# Altium project IMX219_Bridge.PrjPcb
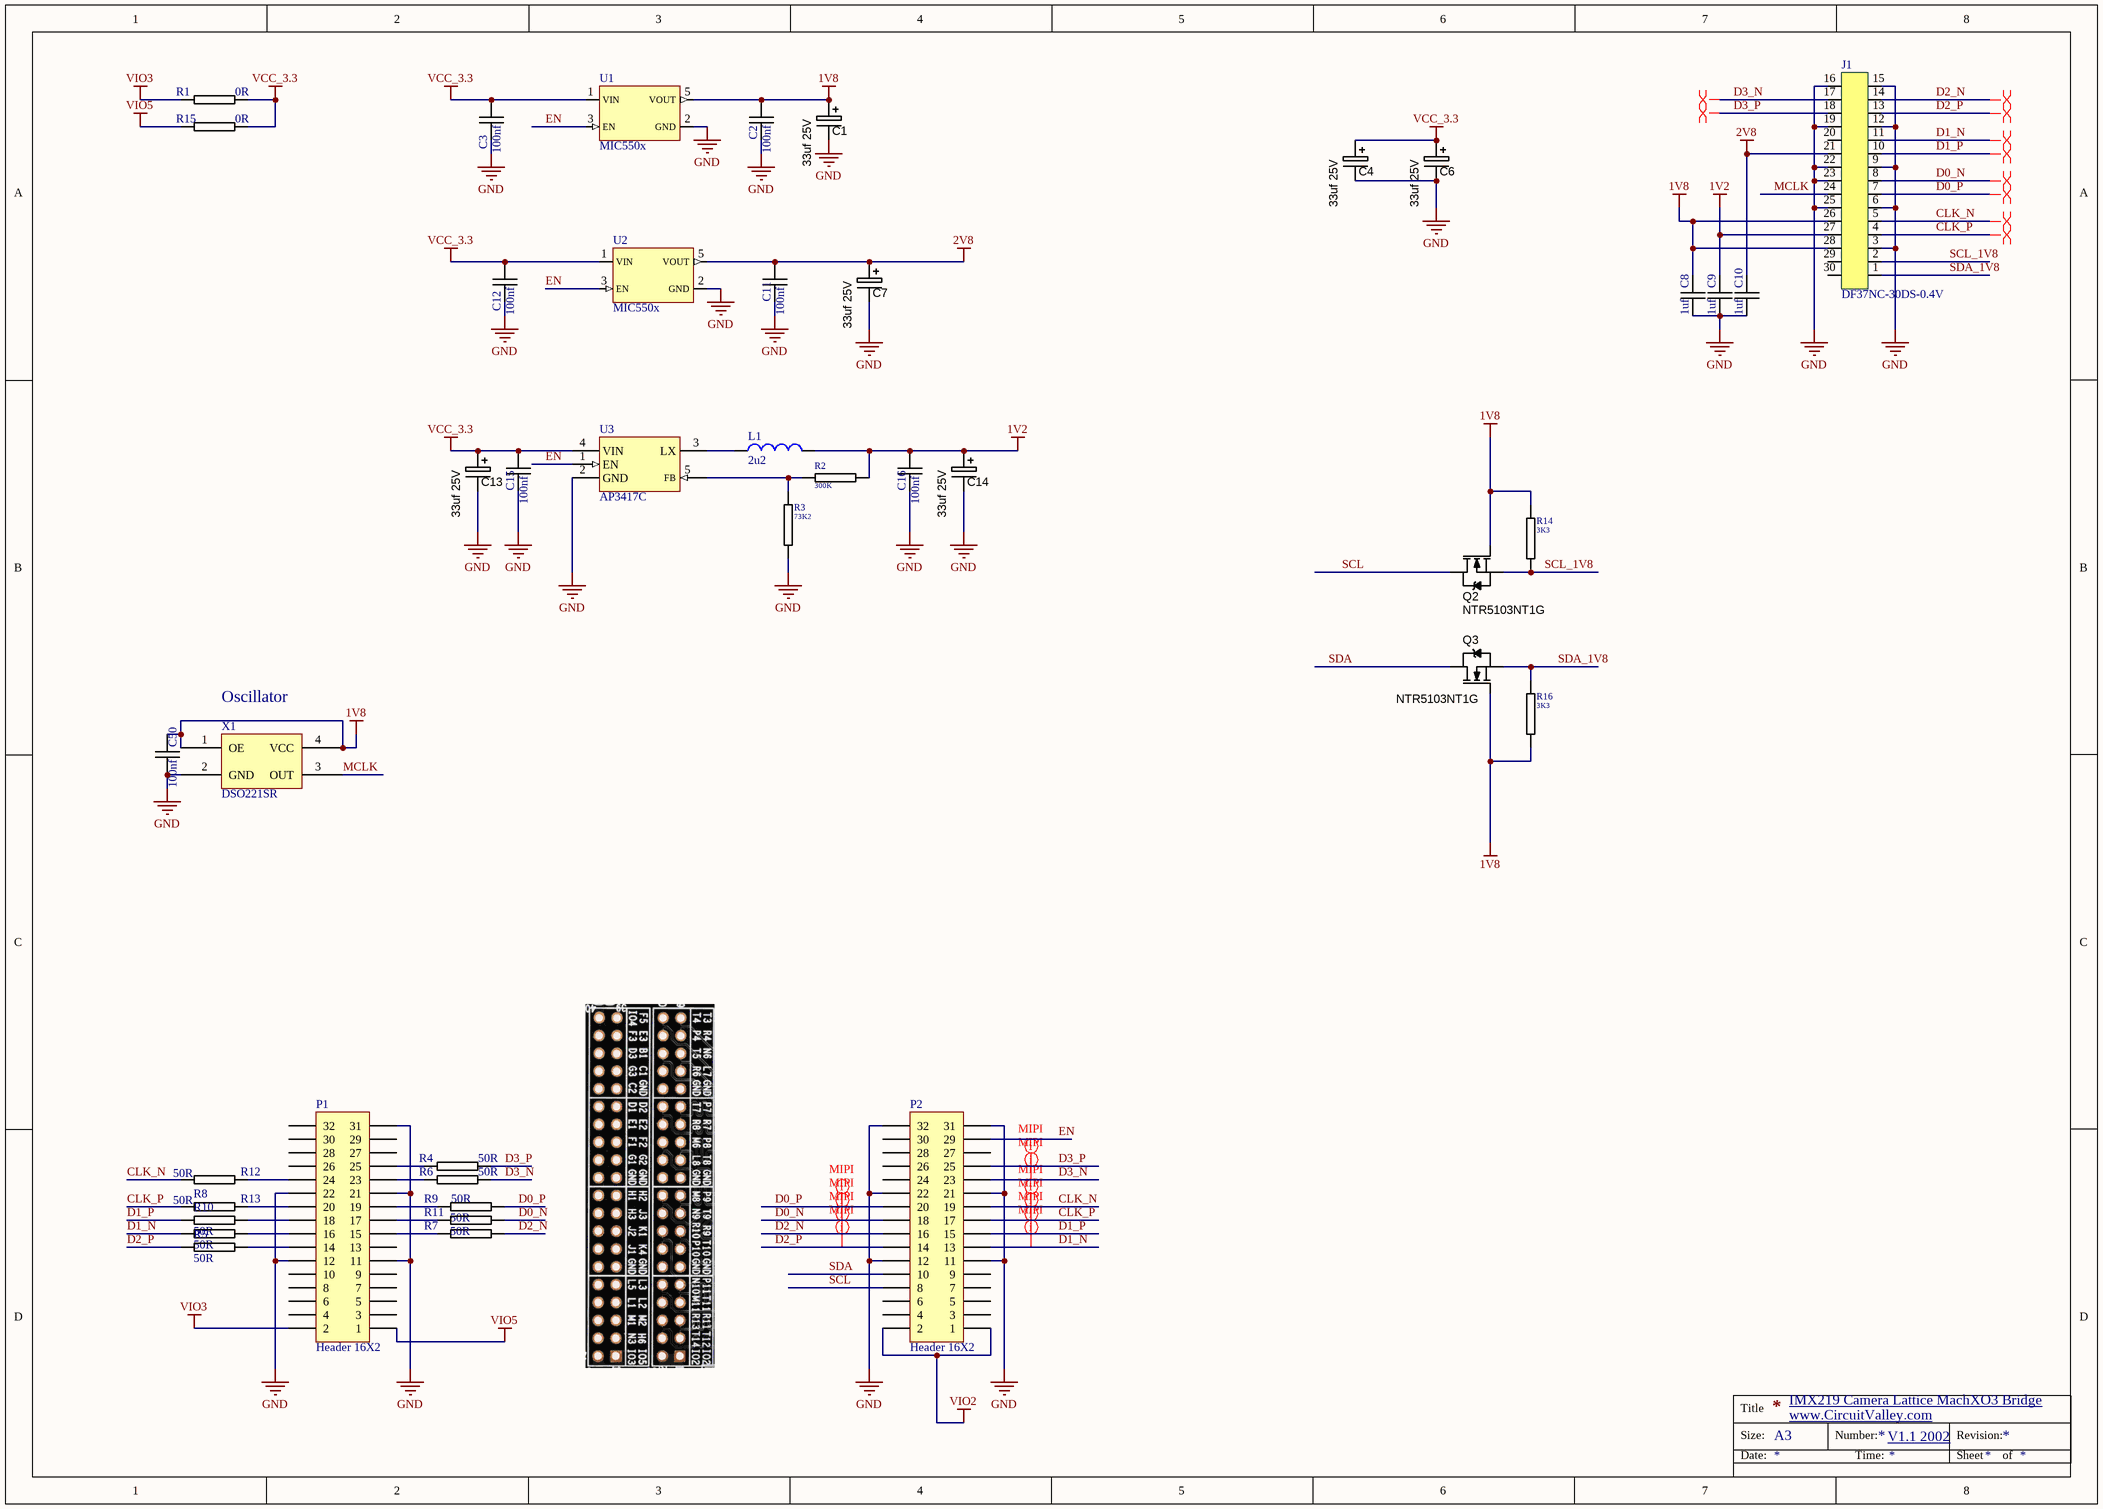
[diagram p0: IMX219_Bridge.SchDoc]
1 sheet, 42 parts. Net scope: global (net labels, ports and power ports of the same name join across sheets).
Board file: IMX219_Bridge.PcbDoc

## Sheet IMX219_Bridge.SchDoc
size A3

### Parts
C1  value 33uf 25V  [CAPMP7343X310N]  (hidden comment: 33uf 20V D)
C2  100nf  [0603C-GENERIC]
C3  100nf  [0603C-GENERIC]
C4  value 33uf 25V  [CAPMP7343X310N]  (hidden comment: 33uf 20V D)
C6  value 33uf 25V  [CAPMP7343X310N]  (hidden comment: 33uf 20V D)
C7  value 33uf 25V  [CAPMP7343X310N]  (hidden comment: 33uf 20V D)
C8  1uf  [0805C-TBD]
C9  1uf  [0805C-TBD]
C10  1uf  [0805C-TBD]
C11  100nf  [0603C-GENERIC]
C12  100nf  [0603C-GENERIC]
C13  value 33uf 25V  [CAPMP7343X310N]  (hidden comment: 33uf 20V D)
C14  value 33uf 25V  [CAPMP7343X310N]  (hidden comment: 33uf 20V D)
C15  100nf  [0603C-GENERIC]
C16  100nf  [0603C-GENERIC]
C50  100nf  [0603C-GENERIC]
J1  DF37NC-30DS-0.4V  [DF37NC-30DS-0.4V]
L1  2u2  [TAIYO_NRS4018T2R2MDGJ]
P1  Header 16X2  [HDR2X16]
P2  Header 16X2  [HDR2X16]
Q2  NTR5103NT1G  [SOT23-3]
Q3  NTR5103NT1G  [SOT23-3]
R1  0R  [0805R-0R1]
R2  300K  [0603R-10K]
R3  73K2  [0603R-10K]
R4  50R  [0805R-0R1]
R5  50R  [0805R-0R1]
R6  50R  [0805R-0R1]
R7  50R  [0805R-0R1]
R8  50R  [0805R-0R1]
R9  50R  [0805R-0R1]
R10  50R  [0805R-0R1]
R11  50R  [0805R-0R1]
R12  50R  [0805R-0R1]
R13  50R  [0805R-0R1]
R14  3K3  [0603R-10K]
R15  0R  [0805R-0R1]
R16  3K3  [0603R-10K]
U1  MIC550x  [SOT23-5]
U2  MIC550x  [SOT23-5]
U3  AP3417C  [SOT23-5]
X1  DSO221SR  [Active Oscillator 2520]

### Nets
1V2: C9.1 C14.1 C16.2 J1.27 L1.2 R2.2
1V8: C1.1 C2.2 C8.1 C50.2 J1.26 J1.28 Q2.1(G) Q3.1(G) R14.2 R16.1 U1.5(VOUT) X1.1(OE) X1.4(VCC)
2V8: C7.1 C10.1 C11.2 J1.21 U2.5(VOUT)
GND: C1.2 C2.1 C3.1 C4.2 C6.2 C7.2 C8.2 C9.2 C10.2 C11.1 C12.1 C13.2 C14.2 C15.1 C16.1 C50.1 J1.3 J1.6 J1.9 J1.12 J1.15 J1.16 J1.19 J1.22 J1.23 J1.25 P1.11 P1.12 P1.21 P1.22 P1.31 P2.11 P2.12 P2.21 P2.22 P2.31 P2.32 R3.1 U1.2(GND) U2.2(GND) U3.2(GND) X1.2(GND)
VCC_3.3: C3.2 C4.1 C6.1 C12.2 C13.1 C15.2 R1.2 R15.2 U1.1(VIN) U2.1(VIN) U3.4(VIN)
VIO2: P2.1 P2.2
VIO3: P1.2 R1.1
VIO5: P1.1 R15.1
CLK_N: J1.5 P2.19 R12.2
CLK_P: J1.4 P2.17 R13.2
D0_N: J1.8 P2.18 R11.2
D0_P: J1.7 P2.20 R9.2
D1_N: J1.11 P2.13 R10.2
D1_P: J1.10 P2.15 R8.2
D2_N: J1.14 P2.16 R7.1
D2_P: J1.13 P2.14 R5.2
D3_N: J1.17 P2.23 R6.2
D3_P: J1.18 P2.25 R4.2
EN: P2.29 U1.3(EN) U2.3(EN) U3.1(EN)
MCLK: J1.24 X1.3(OUT)
SCL: P2.8 Q2.3(D)
SCL_1V8: J1.2 Q2.2(S) R14.1
SDA: P2.10 Q3.3(D)
SDA_1V8: J1.1 Q3.2(S) R16.2
NetL1_1: L1.1 U3.3(LX)
NetP1_14: P1.14 R5.1
NetP1_15: P1.15 R7.2
NetP1_16: P1.16 R10.1
NetP1_17: P1.17 R11.1
NetP1_18: P1.18 R8.1
NetP1_19: P1.19 R9.1
NetP1_20: P1.20 R13.1
NetP1_23: P1.23 R6.1
NetP1_24: P1.24 R12.1
NetP1_25: P1.25 R4.1
NetR2_1: R2.1 R3.2 U3.5(FB)

Not connected (* = marked no-connect by the designer): J1 20 29 30; P1 3 4 5 6 7 8 9 10 13 26 27 28 29 30 32; P2 3 4 5 6 7 9 24 26 27 28 30

### Layout directives
net class MIPI: CLK_N, CLK_P, D0_N, D0_P, D1_N, D1_P, D2_N, D2_P, D3_N, D3_P
differential pair: CLK_N, CLK_P, D0_N, D0_P, D1_N, D1_P, D2_N, D2_P, D3_N, D3_P

### Notes on the sheet
- (near X1) Oscillator
- IMX219 Camera Lattice MachXO3 Bridge
- www.CircuitValley.com
- V1.1 2002
- Title
- Size:
- Date:
- A3
- Number:
- Time:
- Revision:
- Sheet
- of

### Library data of the parts
C1 C4 C6 C7 C13 C14 = CAPT_330u_2917_6V3: Capacitor SMD Tant 330uF 20% 6V3 2917; Manufacturer Part Number: T520D337M006ATE015; Part: TAJD336K020R; Ratings: 6.3V; Material: Solid Tantalum; ESR (Equivalent Series Resistance): 15 mOhm; Package / Case: 2917 (7343 Metric); Tolerance: ±20%; Operating Temperature: -55°C ~ 125°C; Size / Dimension: 0.287" L x 0.169" W (7.30mm x 4.30mm); Height - Seated (Max): 0.122" (3.10mm); Manufacturer Size Code: D; Supplier 1: Digi-Key; Supplier Part Number 1: 399-4052-1-ND; ComponentLink1URL: http://www.kemet.com/datasheets&T520D337M006ATE015; ComponentLink1Description: T520D Datasheet
C2 C3 C11 C12 C15 C16 C50 = 0603C-10UF-6V3-X5R-MUR: CAPACITOR 0603 CERAMIC; Manufacturer: Murata Electronics North America; Manufacturer Part Number: GRM188R60J106ME47D; Reel: C24; Supplier 1: Digi-Key; Supplier Part Number 1: 490-3896-2-ND
C8-C10 = 0805C-TBD: CAPACITOR 0805 CERAMIC VALUE TO BE DETERMINED
J1 = 30_Pin_Dual
L1 = inductor_smd: PartNumber: NRS4018T2R2MDGJ
P1 P2 = Header 16X2: Header, 16-Pin, Dual row; LatestRevisionDate: 17-Jul-2002; LatestRevisionNote: Re-released for DXP Platform.; Publisher: Altium Limited
Q2 Q3 = MOSFET_BSS123: MOSFET SMD N-CH 100V 170mA SOT23-3; Manufacturer 1: Diodes Inc; Manufacturer Part Number 1: BSS123-7-F; Ratings: 100V; 170mA; Material: Metal Oxide; Package / Case: SOT23-3; Supplier 1: Digi-Key; Supplier Part Number 1: BSS123-FDICT-ND
R1 R4-R13 R15 = 0805R-0R1: RESISTOR 0805 1 WATT; Manufacturer Part Number: RL1220S-R10-F; Manufacturer: Susumu; Reel: *; Supplier 1: Digi-Key; Supplier Part Number 1: RL12S.10FTR-ND
R2 R3 R14 R16 = 0603R-10K: GENERIC RESISTOR 0603; Manufacturer: Stackpole Electronics Inc; Manufacturer Part Number: RMCF 1/16 10K 1% R; Tolerance: ±1%; Power (Watts): 0.1W, 1/10W; Temperature Coefficient: ±100ppm/°C; Resistance In Ohms: 10.0K; Reel: R21; Category: Resistors; Supplier Part Number: RMCF1/1610KFRDKR-ND; Lead Style: Surface Mount (SMD - SMT); RoHS: RoHS Compliant; Packaging: Digi-Reel®; Case: 0603 (1608 metric); Composition: Thick Film; Supplier: Digi-Key; Supplier 1: Digi-Key; Supplier Part Number 1: RMCF0603FT10K0DKR-ND
X1 = Oscillator_2520: Active Oscillator_2520